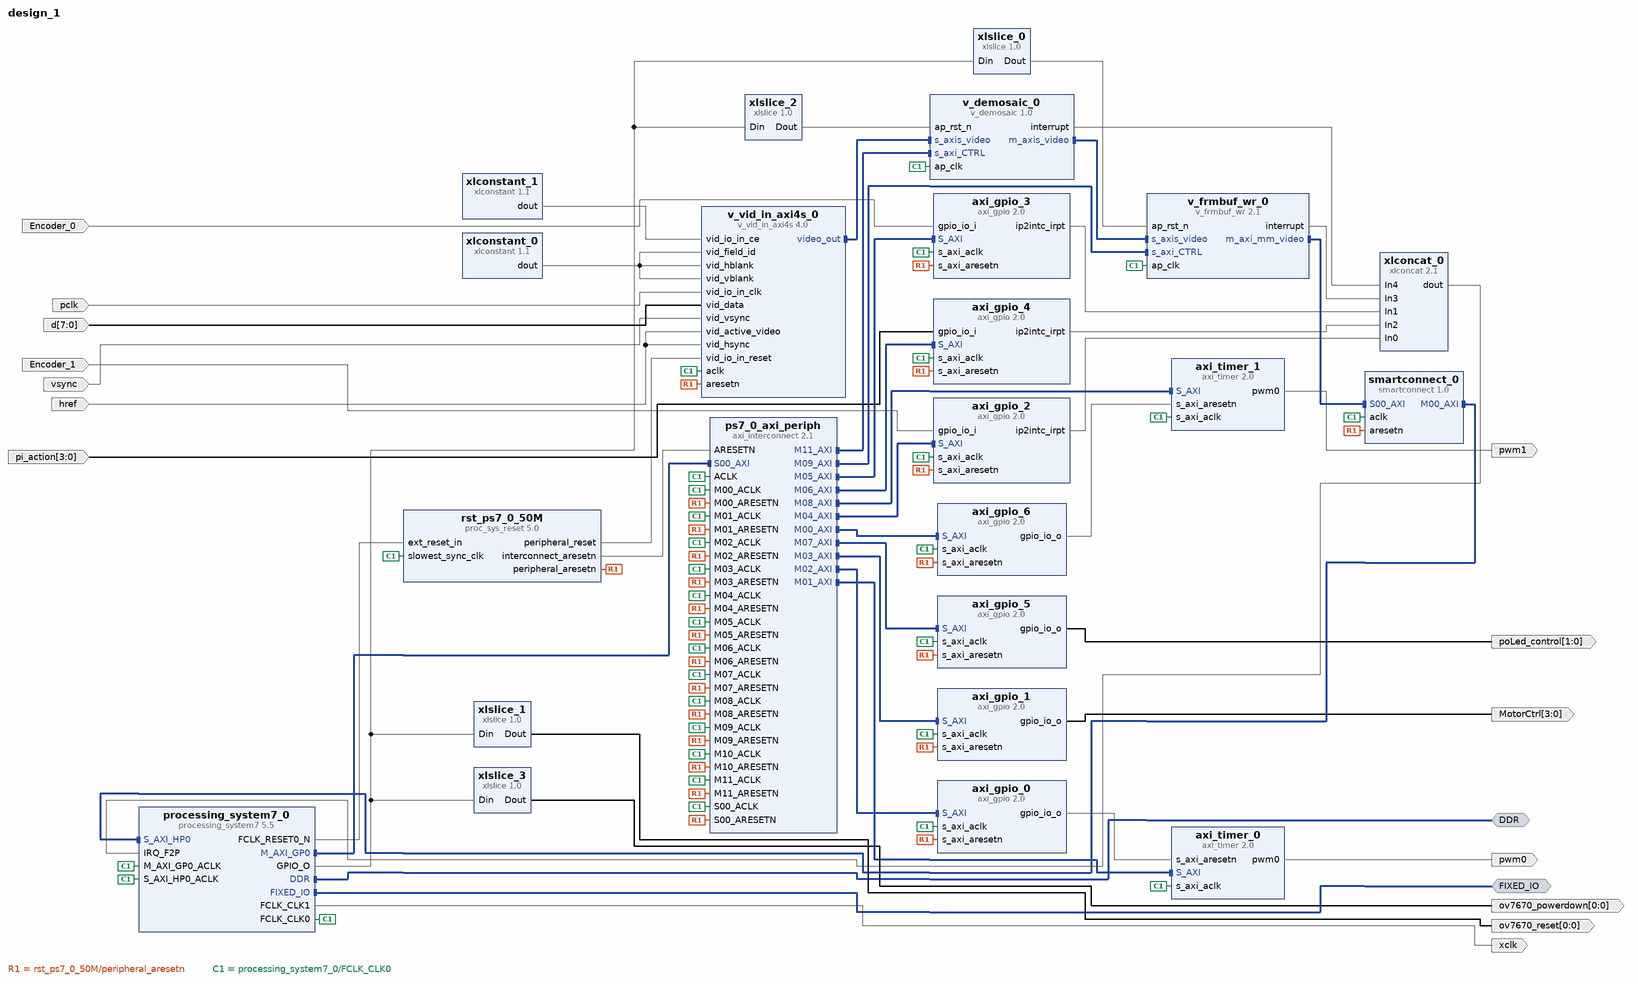
[diagram p0: block diagram of the top level]
# Vivado block design design_1, xc7z010clg400-1, Vivado 2019.1
create_bd_design design_1

create_bd_intf_port -mode Master -vlnv xilinx.com:interface:ddrx_rtl:1.0 DDR
create_bd_intf_port -mode Master -vlnv xilinx.com:display_processing_system7:fixedio_rtl:1.0 FIXED_IO
create_bd_port -dir I pclk
create_bd_port -dir I vsync
create_bd_port -dir I href
create_bd_port -dir I -from 7 -to 0 d
create_bd_port -dir O xclk
create_bd_port -dir O pwm0
create_bd_port -dir O -from 3 -to 0 MotorCtrl
create_bd_port -dir I Encoder_0
create_bd_port -dir I Encoder_1
create_bd_port -dir I -from 3 -to 0 pi_action
create_bd_port -dir O -from 1 -to 0 poLed_control
create_bd_port -dir O pwm1
create_bd_port -dir O -from 0 -to 0 ov7670_reset
create_bd_port -dir O -from 0 -to 0 ov7670_powerdown

create_bd_cell -type ip -vlnv xilinx.com:ip:processing_system7:5.5 processing_system7_0
set_property -dict [list \
  CONFIG.PCW_APU_PERIPHERAL_FREQMHZ 667 \
  CONFIG.PCW_ENET0_ENET0_IO {MIO 16 .. 27} \
  CONFIG.PCW_ENET0_GRP_MDIO_ENABLE 1 \
  CONFIG.PCW_ENET0_GRP_MDIO_IO {MIO 52 .. 53} \
  CONFIG.PCW_ENET0_PERIPHERAL_ENABLE 1 \
  CONFIG.PCW_ENET0_RESET_ENABLE 0 \
  CONFIG.PCW_ENET_RESET_ENABLE 1 \
  CONFIG.PCW_ENET_RESET_SELECT {Share reset pin} \
  CONFIG.PCW_EN_CLK1_PORT 1 \
  CONFIG.PCW_FCLK_CLK1_BUF TRUE \
  CONFIG.PCW_FPGA0_PERIPHERAL_FREQMHZ 100 \
  CONFIG.PCW_FPGA1_PERIPHERAL_FREQMHZ 25 \
  CONFIG.PCW_FPGA_FCLK1_ENABLE 1 \
  CONFIG.PCW_GPIO_EMIO_GPIO_ENABLE 1 \
  CONFIG.PCW_GPIO_EMIO_GPIO_IO 64 \
  CONFIG.PCW_GPIO_MIO_GPIO_ENABLE 1 \
  CONFIG.PCW_GPIO_MIO_GPIO_IO MIO \
  CONFIG.PCW_I2C0_GRP_INT_ENABLE 1 \
  CONFIG.PCW_I2C0_GRP_INT_IO EMIO \
  CONFIG.PCW_I2C0_I2C0_IO {MIO 10 .. 11} \
  CONFIG.PCW_I2C0_PERIPHERAL_ENABLE 1 \
  CONFIG.PCW_I2C_PERIPHERAL_FREQMHZ 111.111115 \
  CONFIG.PCW_I2C_RESET_ENABLE 1 \
  CONFIG.PCW_I2C_RESET_SELECT {Share reset pin} \
  CONFIG.PCW_IRQ_F2P_INTR 1 \
  CONFIG.PCW_PERIPHERAL_BOARD_PRESET part0 \
  CONFIG.PCW_PRESET_BANK1_VOLTAGE {LVCMOS 1.8V} \
  CONFIG.PCW_QSPI_GRP_FBCLK_ENABLE 1 \
  CONFIG.PCW_QSPI_GRP_FBCLK_IO {MIO 8} \
  CONFIG.PCW_QSPI_GRP_SINGLE_SS_ENABLE 1 \
  CONFIG.PCW_QSPI_GRP_SINGLE_SS_IO {MIO 1 .. 6} \
  CONFIG.PCW_QSPI_PERIPHERAL_ENABLE 1 \
  CONFIG.PCW_QSPI_QSPI_IO {MIO 1 .. 6} \
  CONFIG.PCW_SD0_GRP_CD_ENABLE 1 \
  CONFIG.PCW_SD0_GRP_CD_IO {MIO 47} \
  CONFIG.PCW_SD0_GRP_WP_ENABLE 0 \
  CONFIG.PCW_SD0_PERIPHERAL_ENABLE 1 \
  CONFIG.PCW_SD0_SD0_IO {MIO 40 .. 45} \
  CONFIG.PCW_SDIO_PERIPHERAL_FREQMHZ 50 \
  CONFIG.PCW_SINGLE_QSPI_DATA_MODE x4 \
  CONFIG.PCW_UART1_PERIPHERAL_ENABLE 1 \
  CONFIG.PCW_UART1_UART1_IO {MIO 48 .. 49} \
  CONFIG.PCW_UART_PERIPHERAL_FREQMHZ 100 \
  CONFIG.PCW_UIPARAM_DDR_FREQ_MHZ 533.333333 \
  CONFIG.PCW_UIPARAM_DDR_MEMORY_TYPE {DDR 3 (Low Voltage)} \
  CONFIG.PCW_UIPARAM_DDR_PARTNO {MT41K256M16 RE-125} \
  CONFIG.PCW_USB0_PERIPHERAL_ENABLE 1 \
  CONFIG.PCW_USB0_RESET_ENABLE 1 \
  CONFIG.PCW_USB0_RESET_IO {MIO 46} \
  CONFIG.PCW_USB0_USB0_IO {MIO 28 .. 39} \
  CONFIG.PCW_USB_RESET_ENABLE 1 \
  CONFIG.PCW_USB_RESET_SELECT {Share reset pin} \
  CONFIG.PCW_USE_FABRIC_INTERRUPT 1 \
  CONFIG.PCW_USE_S_AXI_HP0 1 \
] [get_bd_cells processing_system7_0]
# 514 more settings of processing_system7_0 are not shown: defaults, MIO pin electricals, DDR timing, and values the tool derives
create_bd_cell -type ip -vlnv xilinx.com:ip:axi_interconnect:2.1 ps7_0_axi_periph
set_property -dict {CONFIG.NUM_MI 12 CONFIG.NUM_SI 1} [get_bd_cells ps7_0_axi_periph]
create_bd_cell -type ip -vlnv xilinx.com:ip:proc_sys_reset:5.0 rst_ps7_0_50M
create_bd_cell -type ip -vlnv xilinx.com:ip:axi_timer:2.0 axi_timer_0
create_bd_cell -type ip -vlnv xilinx.com:ip:axi_gpio:2.0 axi_gpio_0
set_property -dict {CONFIG.C_ALL_OUTPUTS 1 CONFIG.C_GPIO_WIDTH 1} [get_bd_cells axi_gpio_0]
create_bd_cell -type ip -vlnv xilinx.com:ip:axi_gpio:2.0 axi_gpio_1
set_property -dict [list \
  CONFIG.C_ALL_INPUTS 0 \
  CONFIG.C_ALL_OUTPUTS 1 \
  CONFIG.C_GPIO_WIDTH 4 \
  CONFIG.C_INTERRUPT_PRESENT 0 \
  CONFIG.C_IS_DUAL 0 \
] [get_bd_cells axi_gpio_1]
create_bd_cell -type ip -vlnv xilinx.com:ip:xlconcat:2.1 xlconcat_0
set_property -dict {CONFIG.NUM_PORTS 5} [get_bd_cells xlconcat_0]
create_bd_cell -type ip -vlnv xilinx.com:ip:axi_gpio:2.0 axi_gpio_2
set_property -dict {CONFIG.C_ALL_INPUTS 1 CONFIG.C_GPIO_WIDTH 1 CONFIG.C_INTERRUPT_PRESENT 1} [get_bd_cells axi_gpio_2]
create_bd_cell -type ip -vlnv xilinx.com:ip:axi_gpio:2.0 axi_gpio_3
set_property -dict {CONFIG.C_ALL_INPUTS 1 CONFIG.C_GPIO_WIDTH 1 CONFIG.C_INTERRUPT_PRESENT 1} [get_bd_cells axi_gpio_3]
create_bd_cell -type ip -vlnv xilinx.com:ip:axi_gpio:2.0 axi_gpio_4
set_property -dict [list \
  CONFIG.C_ALL_INPUTS 1 \
  CONFIG.C_GPIO_WIDTH 4 \
  CONFIG.C_INTERRUPT_PRESENT 1 \
  CONFIG.C_IS_DUAL 0 \
] [get_bd_cells axi_gpio_4]
create_bd_cell -type ip -vlnv xilinx.com:ip:axi_gpio:2.0 axi_gpio_5
set_property -dict {CONFIG.C_ALL_OUTPUTS 1 CONFIG.C_GPIO_WIDTH 2} [get_bd_cells axi_gpio_5]
create_bd_cell -type ip -vlnv xilinx.com:ip:axi_timer:2.0 axi_timer_1
create_bd_cell -type ip -vlnv xilinx.com:ip:axi_gpio:2.0 axi_gpio_6
set_property -dict {CONFIG.C_ALL_OUTPUTS 1 CONFIG.C_GPIO_WIDTH 1} [get_bd_cells axi_gpio_6]
create_bd_cell -type ip -vlnv xilinx.com:ip:v_frmbuf_wr:2.1 v_frmbuf_wr_0
set_property -dict [list \
  CONFIG.AXIMM_ADDR_WIDTH 32 \
  CONFIG.AXIMM_DATA_WIDTH 64 \
  CONFIG.C_M_AXI_MM_VIDEO_DATA_WIDTH 64 \
  CONFIG.HAS_BGR8 1 \
  CONFIG.HAS_BGRX8 1 \
  CONFIG.HAS_INTERLACED 0 \
  CONFIG.HAS_RGB8 1 \
  CONFIG.HAS_RGBX8 1 \
  CONFIG.HAS_UYVY8 1 \
  CONFIG.HAS_Y8 1 \
  CONFIG.HAS_YUV8 1 \
  CONFIG.HAS_YUVX8 1 \
  CONFIG.HAS_YUYV8 1 \
  CONFIG.HAS_Y_UV8 1 \
  CONFIG.HAS_Y_UV8_420 1 \
  CONFIG.MAX_COLS 1080 \
  CONFIG.MAX_DATA_WIDTH 8 \
  CONFIG.MAX_NR_PLANES 2 \
  CONFIG.MAX_ROWS 720 \
  CONFIG.SAMPLES_PER_CLOCK 1 \
] [get_bd_cells v_frmbuf_wr_0]
create_bd_cell -type ip -vlnv xilinx.com:ip:smartconnect:1.0 smartconnect_0
set_property -dict {CONFIG.NUM_SI 1} [get_bd_cells smartconnect_0]
create_bd_cell -type ip -vlnv xilinx.com:ip:xlslice:1.0 xlslice_0
set_property -dict {CONFIG.DIN_FROM 0 CONFIG.DIN_TO 0 CONFIG.DIN_WIDTH 64} [get_bd_cells xlslice_0]
create_bd_cell -type ip -vlnv xilinx.com:ip:v_demosaic:1.0 v_demosaic_0
set_property -dict {CONFIG.MAX_COLS 1080 CONFIG.MAX_ROWS 720} [get_bd_cells v_demosaic_0]
create_bd_cell -type ip -vlnv xilinx.com:ip:xlslice:1.0 xlslice_2
set_property -dict {CONFIG.DIN_FROM 1 CONFIG.DIN_TO 1 CONFIG.DIN_WIDTH 64 CONFIG.DOUT_WIDTH 1} [get_bd_cells xlslice_2]
create_bd_cell -type ip -vlnv xilinx.com:ip:v_vid_in_axi4s:4.0 v_vid_in_axi4s_0
set_property -dict {CONFIG.C_HAS_ASYNC_CLK 1 CONFIG.C_M_AXIS_VIDEO_FORMAT 12} [get_bd_cells v_vid_in_axi4s_0]
create_bd_cell -type ip -vlnv xilinx.com:ip:xlconstant:1.1 xlconstant_0
set_property -dict {CONFIG.CONST_VAL 0} [get_bd_cells xlconstant_0]
create_bd_cell -type ip -vlnv xilinx.com:ip:xlconstant:1.1 xlconstant_1
set_property -dict {CONFIG.CONST_VAL 1} [get_bd_cells xlconstant_1]
create_bd_cell -type ip -vlnv xilinx.com:ip:xlslice:1.0 xlslice_1
set_property -dict {CONFIG.DIN_FROM 2 CONFIG.DIN_TO 2 CONFIG.DIN_WIDTH 64 CONFIG.DOUT_WIDTH 1} [get_bd_cells xlslice_1]
create_bd_cell -type ip -vlnv xilinx.com:ip:xlslice:1.0 xlslice_3
set_property -dict {CONFIG.DIN_FROM 3 CONFIG.DIN_TO 3 CONFIG.DIN_WIDTH 64 CONFIG.DOUT_WIDTH 1} [get_bd_cells xlslice_3]

# ---- connections ----

connect_bd_intf_net [get_bd_intf_pins ps7_0_axi_periph/M00_AXI] [get_bd_intf_pins axi_gpio_6/S_AXI]
connect_bd_intf_net [get_bd_intf_pins ps7_0_axi_periph/M04_AXI] [get_bd_intf_pins axi_gpio_2/S_AXI]
connect_bd_intf_net [get_bd_intf_pins ps7_0_axi_periph/M11_AXI] [get_bd_intf_pins v_demosaic_0/s_axi_CTRL]
connect_bd_intf_net [get_bd_intf_pins processing_system7_0/M_AXI_GP0] [get_bd_intf_pins ps7_0_axi_periph/S00_AXI]
connect_bd_intf_net [get_bd_intf_pins ps7_0_axi_periph/M02_AXI] [get_bd_intf_pins axi_gpio_0/S_AXI]
connect_bd_intf_net [get_bd_intf_pins v_vid_in_axi4s_0/video_out] [get_bd_intf_pins v_demosaic_0/s_axis_video]
connect_bd_intf_net [get_bd_intf_pins v_demosaic_0/m_axis_video] [get_bd_intf_pins v_frmbuf_wr_0/s_axis_video]
connect_bd_intf_net [get_bd_intf_pins smartconnect_0/M00_AXI] [get_bd_intf_pins processing_system7_0/S_AXI_HP0]
connect_bd_intf_net [get_bd_intf_pins ps7_0_axi_periph/M06_AXI] [get_bd_intf_pins axi_gpio_4/S_AXI]
connect_bd_intf_net [get_bd_intf_pins ps7_0_axi_periph/M01_AXI] [get_bd_intf_pins axi_timer_0/S_AXI]
connect_bd_intf_net [get_bd_intf_pins ps7_0_axi_periph/M09_AXI] [get_bd_intf_pins v_frmbuf_wr_0/s_axi_CTRL]
connect_bd_intf_net [get_bd_intf_ports DDR] [get_bd_intf_pins processing_system7_0/DDR]
connect_bd_intf_net [get_bd_intf_pins ps7_0_axi_periph/M07_AXI] [get_bd_intf_pins axi_gpio_5/S_AXI]
connect_bd_intf_net [get_bd_intf_pins ps7_0_axi_periph/M05_AXI] [get_bd_intf_pins axi_gpio_3/S_AXI]
connect_bd_intf_net [get_bd_intf_ports FIXED_IO] [get_bd_intf_pins processing_system7_0/FIXED_IO]
connect_bd_intf_net [get_bd_intf_pins ps7_0_axi_periph/M03_AXI] [get_bd_intf_pins axi_gpio_1/S_AXI]
connect_bd_intf_net [get_bd_intf_pins v_frmbuf_wr_0/m_axi_mm_video] [get_bd_intf_pins smartconnect_0/S00_AXI]
connect_bd_intf_net [get_bd_intf_pins ps7_0_axi_periph/M08_AXI] [get_bd_intf_pins axi_timer_1/S_AXI]
connect_bd_net [get_bd_pins processing_system7_0/FCLK_RESET0_N] [get_bd_pins rst_ps7_0_50M/ext_reset_in]
connect_bd_net [get_bd_pins rst_ps7_0_50M/interconnect_aresetn] [get_bd_pins ps7_0_axi_periph/ARESETN]
connect_bd_net [get_bd_pins rst_ps7_0_50M/peripheral_aresetn] \
  [get_bd_pins ps7_0_axi_periph/S00_ARESETN] [get_bd_pins ps7_0_axi_periph/M00_ARESETN] \
  [get_bd_pins ps7_0_axi_periph/M01_ARESETN] [get_bd_pins ps7_0_axi_periph/M02_ARESETN] \
  [get_bd_pins axi_gpio_0/s_axi_aresetn] [get_bd_pins ps7_0_axi_periph/M03_ARESETN] [get_bd_pins axi_gpio_1/s_axi_aresetn] \
  [get_bd_pins ps7_0_axi_periph/M04_ARESETN] [get_bd_pins axi_gpio_2/s_axi_aresetn] \
  [get_bd_pins ps7_0_axi_periph/M05_ARESETN] [get_bd_pins axi_gpio_3/s_axi_aresetn] [get_bd_pins axi_gpio_4/s_axi_aresetn] \
  [get_bd_pins ps7_0_axi_periph/M06_ARESETN] [get_bd_pins axi_gpio_5/s_axi_aresetn] \
  [get_bd_pins ps7_0_axi_periph/M07_ARESETN] [get_bd_pins ps7_0_axi_periph/M08_ARESETN] \
  [get_bd_pins axi_gpio_6/s_axi_aresetn] [get_bd_pins ps7_0_axi_periph/M09_ARESETN] \
  [get_bd_pins ps7_0_axi_periph/M10_ARESETN] [get_bd_pins ps7_0_axi_periph/M11_ARESETN] [get_bd_pins smartconnect_0/aresetn] \
  [get_bd_pins v_vid_in_axi4s_0/aresetn]
connect_bd_net [get_bd_pins axi_timer_0/pwm0] [get_bd_ports pwm0]
connect_bd_net [get_bd_pins axi_gpio_0/gpio_io_o] [get_bd_pins axi_timer_0/s_axi_aresetn]
connect_bd_net [get_bd_pins processing_system7_0/FCLK_CLK0] \
  [get_bd_pins processing_system7_0/M_AXI_GP0_ACLK] [get_bd_pins processing_system7_0/S_AXI_HP0_ACLK] \
  [get_bd_pins ps7_0_axi_periph/ACLK] [get_bd_pins ps7_0_axi_periph/S00_ACLK] [get_bd_pins ps7_0_axi_periph/M00_ACLK] \
  [get_bd_pins ps7_0_axi_periph/M01_ACLK] [get_bd_pins rst_ps7_0_50M/slowest_sync_clk] [get_bd_pins axi_timer_0/s_axi_aclk] \
  [get_bd_pins ps7_0_axi_periph/M02_ACLK] [get_bd_pins axi_gpio_0/s_axi_aclk] [get_bd_pins ps7_0_axi_periph/M03_ACLK] \
  [get_bd_pins axi_gpio_1/s_axi_aclk] [get_bd_pins ps7_0_axi_periph/M04_ACLK] [get_bd_pins axi_gpio_2/s_axi_aclk] \
  [get_bd_pins ps7_0_axi_periph/M05_ACLK] [get_bd_pins axi_gpio_3/s_axi_aclk] [get_bd_pins axi_gpio_4/s_axi_aclk] \
  [get_bd_pins ps7_0_axi_periph/M06_ACLK] [get_bd_pins axi_gpio_5/s_axi_aclk] [get_bd_pins ps7_0_axi_periph/M07_ACLK] \
  [get_bd_pins axi_timer_1/s_axi_aclk] [get_bd_pins ps7_0_axi_periph/M08_ACLK] [get_bd_pins axi_gpio_6/s_axi_aclk] \
  [get_bd_pins ps7_0_axi_periph/M09_ACLK] [get_bd_pins ps7_0_axi_periph/M10_ACLK] [get_bd_pins ps7_0_axi_periph/M11_ACLK] \
  [get_bd_pins v_frmbuf_wr_0/ap_clk] [get_bd_pins v_demosaic_0/ap_clk] [get_bd_pins v_vid_in_axi4s_0/aclk] \
  [get_bd_pins smartconnect_0/aclk]
connect_bd_net [get_bd_pins xlconcat_0/dout] [get_bd_pins processing_system7_0/IRQ_F2P]
connect_bd_net [get_bd_pins axi_gpio_1/gpio_io_o] [get_bd_ports MotorCtrl]
connect_bd_net [get_bd_pins axi_gpio_2/ip2intc_irpt] [get_bd_pins xlconcat_0/In0]
connect_bd_net -net Encoder_1_1 [get_bd_ports Encoder_1] [get_bd_pins axi_gpio_2/gpio_io_i]
connect_bd_net -net Encoder_0_1 [get_bd_ports Encoder_0] [get_bd_pins axi_gpio_3/gpio_io_i]
connect_bd_net [get_bd_pins axi_gpio_3/ip2intc_irpt] [get_bd_pins xlconcat_0/In1]
connect_bd_net [get_bd_ports pi_action] [get_bd_pins axi_gpio_4/gpio_io_i]
connect_bd_net [get_bd_pins axi_gpio_5/gpio_io_o] [get_bd_ports poLed_control]
connect_bd_net [get_bd_pins axi_timer_1/pwm0] [get_bd_ports pwm1]
connect_bd_net [get_bd_pins axi_gpio_6/gpio_io_o] [get_bd_pins axi_timer_1/s_axi_aresetn]
connect_bd_net [get_bd_pins processing_system7_0/FCLK_CLK1] [get_bd_ports xclk]
connect_bd_net [get_bd_pins axi_gpio_4/ip2intc_irpt] [get_bd_pins xlconcat_0/In2]
connect_bd_net [get_bd_pins v_frmbuf_wr_0/interrupt] [get_bd_pins xlconcat_0/In3]
connect_bd_net [get_bd_pins processing_system7_0/GPIO_O] \
  [get_bd_pins xlslice_0/Din] [get_bd_pins xlslice_2/Din] [get_bd_pins xlslice_1/Din] [get_bd_pins xlslice_3/Din]
connect_bd_net [get_bd_pins xlslice_0/Dout] [get_bd_pins v_frmbuf_wr_0/ap_rst_n]
connect_bd_net [get_bd_pins v_demosaic_0/interrupt] [get_bd_pins xlconcat_0/In4]
connect_bd_net [get_bd_pins xlslice_2/Dout] [get_bd_pins v_demosaic_0/ap_rst_n]
connect_bd_net [get_bd_ports pclk] [get_bd_pins v_vid_in_axi4s_0/vid_io_in_clk]
connect_bd_net [get_bd_ports d] [get_bd_pins v_vid_in_axi4s_0/vid_data]
connect_bd_net [get_bd_ports vsync] [get_bd_pins v_vid_in_axi4s_0/vid_vsync]
connect_bd_net [get_bd_ports href] [get_bd_pins v_vid_in_axi4s_0/vid_active_video] [get_bd_pins v_vid_in_axi4s_0/vid_hsync]
connect_bd_net [get_bd_pins xlconstant_1/dout] [get_bd_pins v_vid_in_axi4s_0/vid_io_in_ce]
connect_bd_net [get_bd_pins xlconstant_0/dout] \
  [get_bd_pins v_vid_in_axi4s_0/vid_field_id] [get_bd_pins v_vid_in_axi4s_0/vid_hblank] \
  [get_bd_pins v_vid_in_axi4s_0/vid_vblank]
connect_bd_net [get_bd_pins rst_ps7_0_50M/peripheral_reset] [get_bd_pins v_vid_in_axi4s_0/vid_io_in_reset]
connect_bd_net [get_bd_pins xlslice_1/Dout] [get_bd_ports ov7670_reset]
connect_bd_net [get_bd_pins xlslice_3/Dout] [get_bd_ports ov7670_powerdown]

# ---- address map ----
assign_bd_address -offset 0x41200000 -range 64K -target_address_space [get_bd_addr_spaces processing_system7_0/Data] [get_bd_addr_segs axi_gpio_0/S_AXI/Reg]
assign_bd_address -offset 0x41210000 -range 64K -target_address_space [get_bd_addr_spaces processing_system7_0/Data] [get_bd_addr_segs axi_gpio_1/S_AXI/Reg]
assign_bd_address -offset 0x41220000 -range 64K -target_address_space [get_bd_addr_spaces processing_system7_0/Data] [get_bd_addr_segs axi_gpio_2/S_AXI/Reg]
assign_bd_address -offset 0x41230000 -range 64K -target_address_space [get_bd_addr_spaces processing_system7_0/Data] [get_bd_addr_segs axi_gpio_3/S_AXI/Reg]
assign_bd_address -offset 0x41240000 -range 64K -target_address_space [get_bd_addr_spaces processing_system7_0/Data] [get_bd_addr_segs axi_gpio_4/S_AXI/Reg]
assign_bd_address -offset 0x41250000 -range 64K -target_address_space [get_bd_addr_spaces processing_system7_0/Data] [get_bd_addr_segs axi_gpio_5/S_AXI/Reg]
assign_bd_address -offset 0x41260000 -range 64K -target_address_space [get_bd_addr_spaces processing_system7_0/Data] [get_bd_addr_segs axi_gpio_6/S_AXI/Reg]
assign_bd_address -offset 0x42800000 -range 64K -target_address_space [get_bd_addr_spaces processing_system7_0/Data] [get_bd_addr_segs axi_timer_0/S_AXI/Reg]
assign_bd_address -offset 0x42810000 -range 64K -target_address_space [get_bd_addr_spaces processing_system7_0/Data] [get_bd_addr_segs axi_timer_1/S_AXI/Reg]
assign_bd_address -offset 0x43C00000 -range 64K -target_address_space [get_bd_addr_spaces processing_system7_0/Data] [get_bd_addr_segs v_frmbuf_wr_0/s_axi_CTRL/Reg]
assign_bd_address -offset 0x43C20000 -range 64K -target_address_space [get_bd_addr_spaces processing_system7_0/Data] [get_bd_addr_segs v_demosaic_0/s_axi_CTRL/Reg]
assign_bd_address -offset 0x00000000 -range 1G -target_address_space [get_bd_addr_spaces v_frmbuf_wr_0/Data_m_axi_mm_video] [get_bd_addr_segs processing_system7_0/S_AXI_HP0/HP0_DDR_LOWOCM]

validate_bd_design
save_bd_design
